# EAGLE design sensorX (EAGLE 7.2.0)
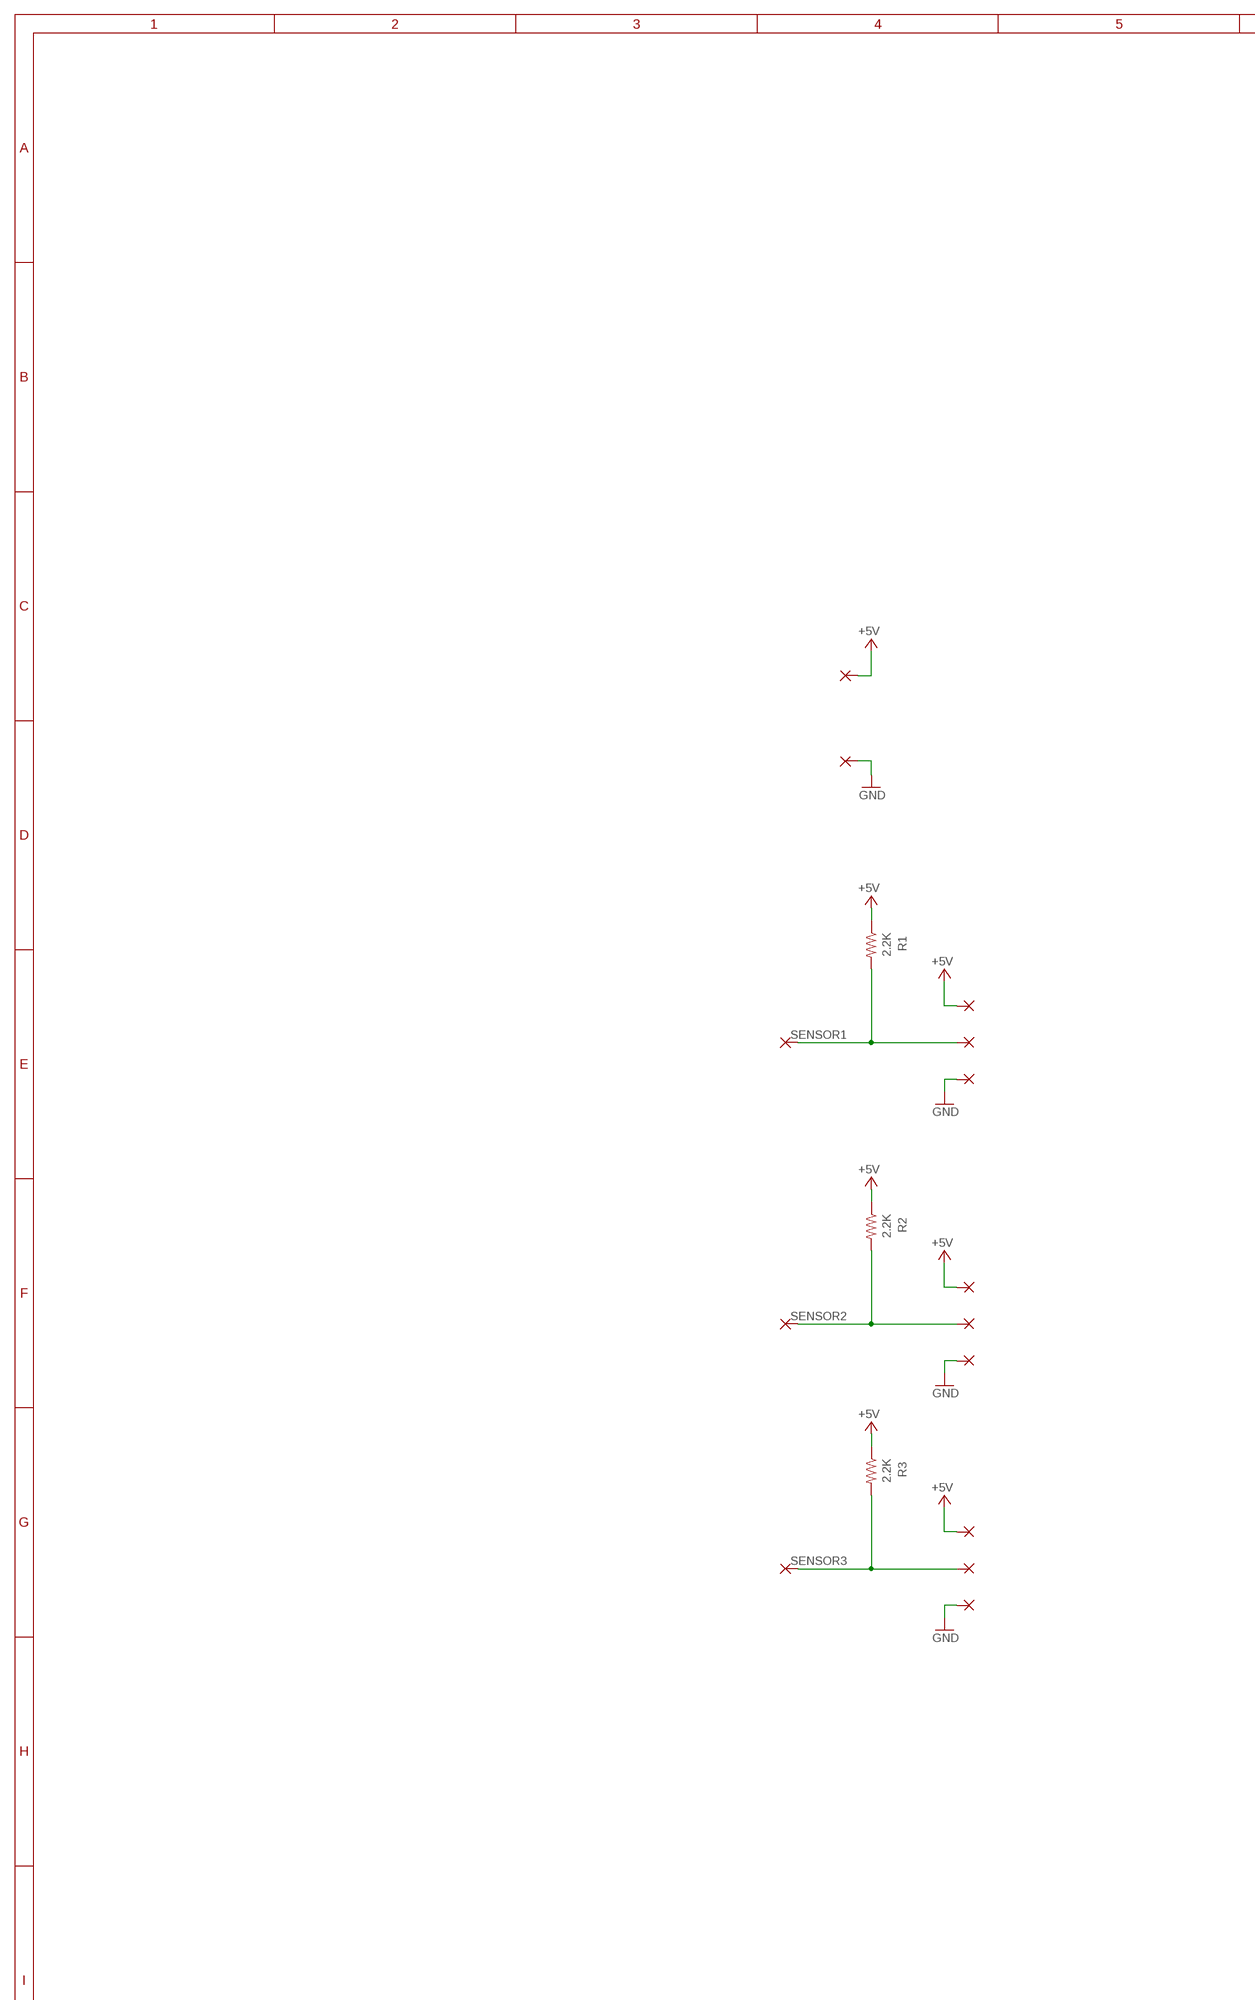
[diagram p0: schematic, sheet 1, part 1 of 2]
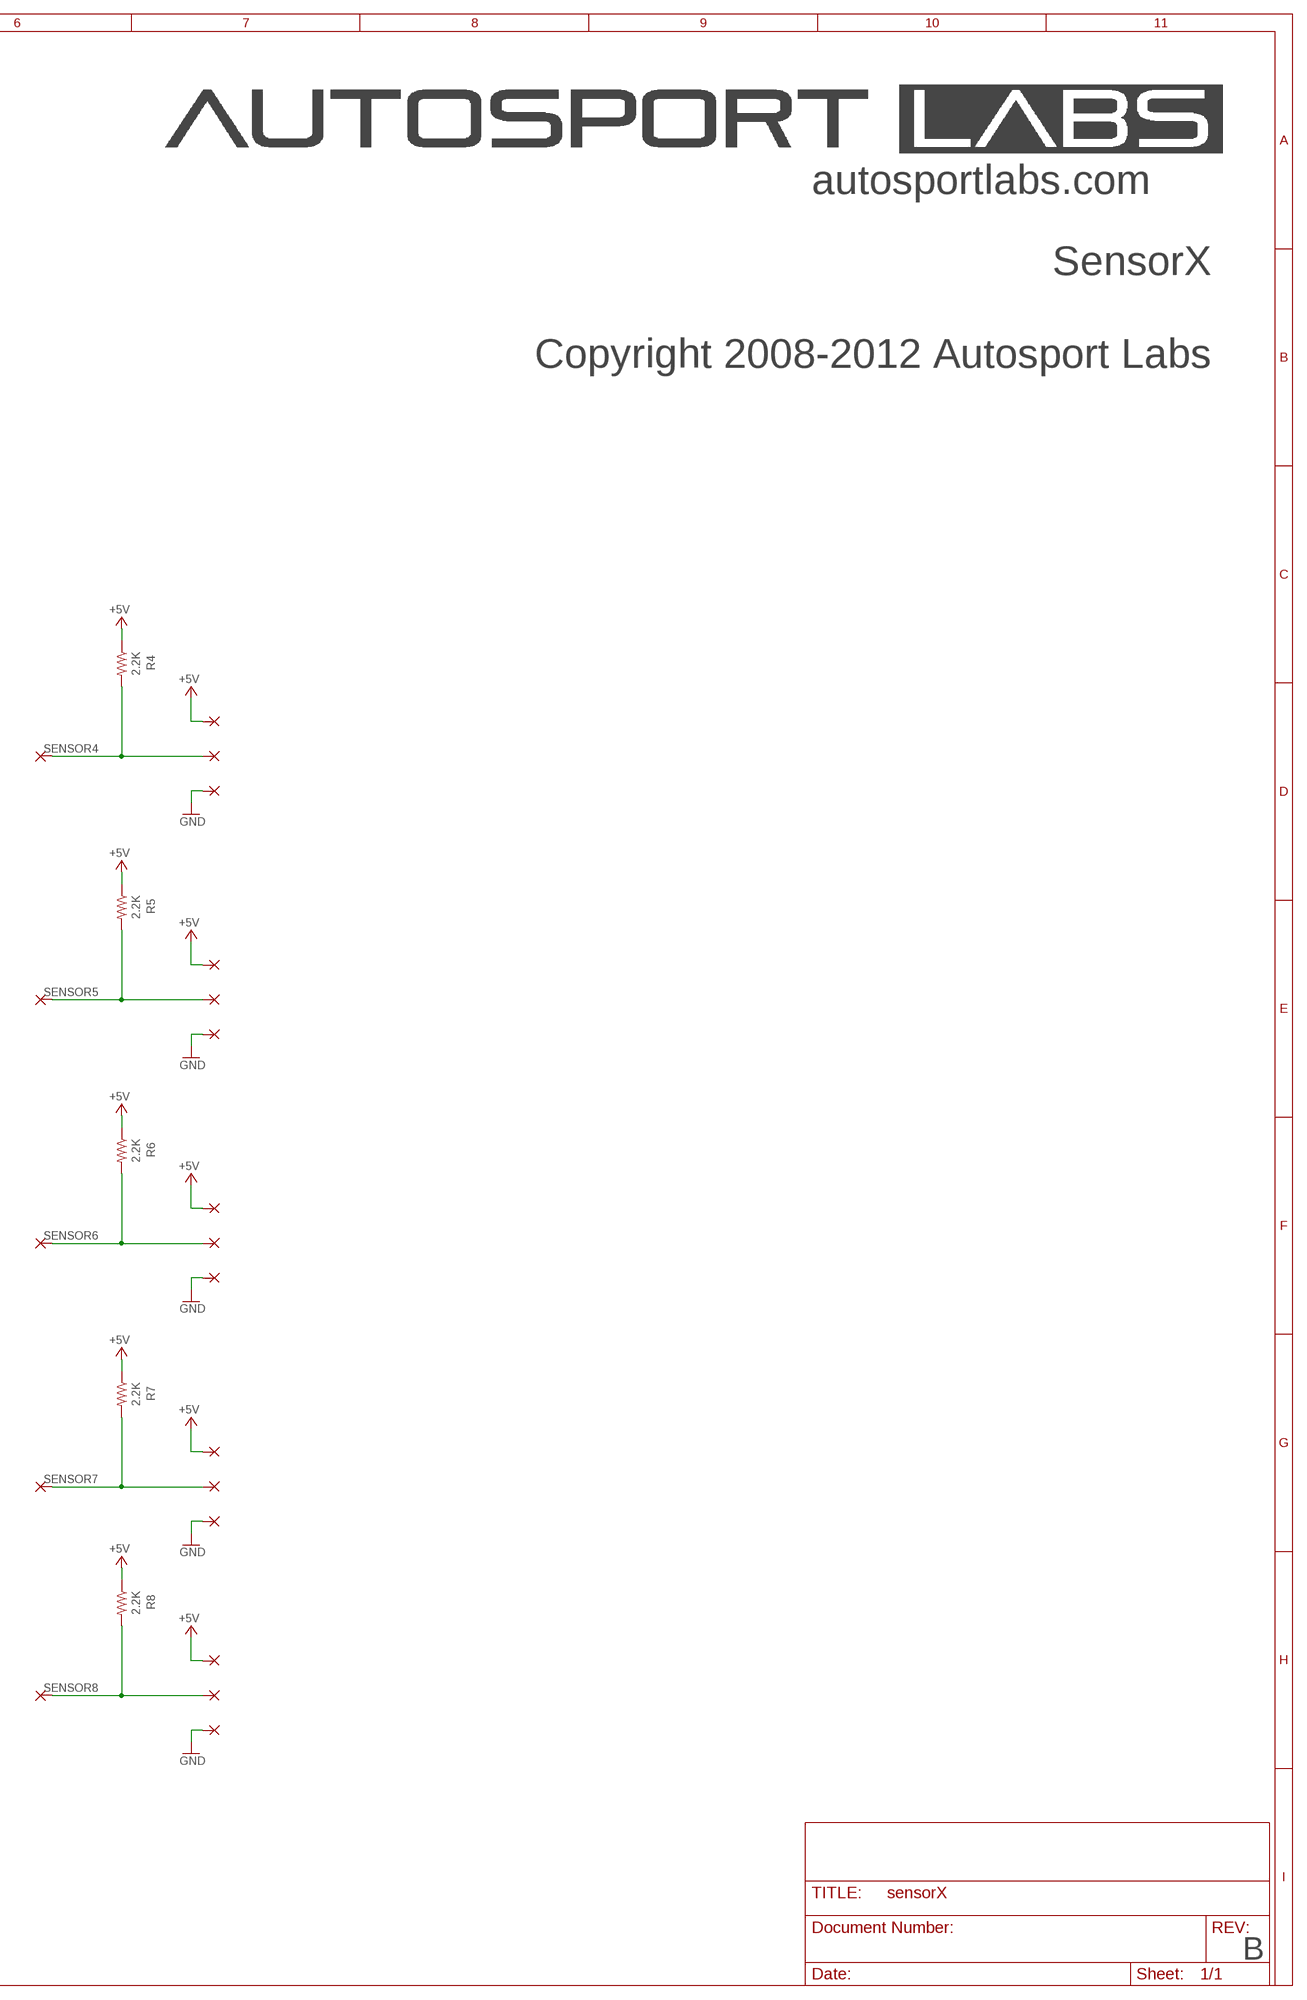
[diagram p1: schematic, sheet 1, part 2 of 2]

## Parts
1  WIREPAD3,17/1,2  [3,17/1,2]
2  WIREPAD3,17/1,2  [3,17/1,2]
3  WIREPAD3,17/1,2  [3,17/1,2]
4  WIREPAD3,17/1,2  [3,17/1,2]
5  WIREPAD3,17/1,2  [3,17/1,2]
5V  WIREPAD3,17/1,2  [3,17/1,2]
5V_1  WIREPAD3,17/1,2  [3,17/1,2]
5V_2  WIREPAD3,17/1,2  [3,17/1,2]
5V_3  WIREPAD3,17/1,2  [3,17/1,2]
5V_4  WIREPAD3,17/1,2  [3,17/1,2]
5V_5  WIREPAD3,17/1,2  [3,17/1,2]
5V_6  WIREPAD3,17/1,2  [3,17/1,2]
5V_7  WIREPAD3,17/1,2  [3,17/1,2]
5V_8  WIREPAD3,17/1,2  [3,17/1,2]
6  WIREPAD3,17/1,2  [3,17/1,2]
7  WIREPAD3,17/1,2  [3,17/1,2]
7_IN  WIREPAD3,17/1,2  [3,17/1,2]
8  WIREPAD3,17/1,2  [3,17/1,2]
8_IN  WIREPAD3,17/1,2  [3,17/1,2]
GND  WIREPAD3,17/1,2  [3,17/1,2]
GND-1  WIREPAD3,17/1,2  [3,17/1,2]
GND_2  WIREPAD3,17/1,2  [3,17/1,2]
GND_3  WIREPAD3,17/1,2  [3,17/1,2]
GND_4  WIREPAD3,17/1,2  [3,17/1,2]
GND_5  WIREPAD3,17/1,2  [3,17/1,2]
GND_6  WIREPAD3,17/1,2  [3,17/1,2]
GND_7  WIREPAD3,17/1,2  [3,17/1,2]
GND_8  WIREPAD3,17/1,2  [3,17/1,2]
IN_1  WIREPAD3,17/1,2  [3,17/1,2]
IN_2  WIREPAD3,17/1,2  [3,17/1,2]
IN_3  WIREPAD3,17/1,2  [3,17/1,2]
IN_4  WIREPAD3,17/1,2  [3,17/1,2]
IN_5  WIREPAD3,17/1,2  [3,17/1,2]
IN_6  WIREPAD3,17/1,2  [3,17/1,2]
R1  2.2K  R-US_0204/5  [0204/5]
R2  2.2K  R-US_0204/5  [0204/5]
R3  2.2K  R-US_0204/5  [0204/5]
R4  2.2K  R-US_0204/5  [0204/5]
R5  2.2K  R-US_0204/5  [0204/5]
R6  2.2K  R-US_0204/5  [0204/5]
R7  2.2K  R-US_0204/5  [0204/5]
R8  2.2K  R-US_0204/5  [0204/5]

## Nets
+5V: 5V.1(P) 5V_1.1(P) 5V_2.1(P) 5V_3.1(P) 5V_4.1(P) 5V_5.1(P) 5V_6.1(P) 5V_7.1(P) 5V_8.1(P) R1.1 R2.1 R3.1 R4.1 R5.1 R6.1 R7.1 R8.1
GND: GND-1.1(P) GND.1(P) GND_2.1(P) GND_3.1(P) GND_4.1(P) GND_5.1(P) GND_6.1(P) GND_7.1(P) GND_8.1(P)
SENSOR1: 1.1(P) IN_1.1(P) R1.2
SENSOR2: 2.1(P) IN_2.1(P) R2.2
SENSOR3: 3.1(P) IN_3.1(P) R3.2
SENSOR4: 4.1(P) IN_4.1(P) R4.2
SENSOR5: 5.1(P) IN_5.1(P) R5.2
SENSOR6: 6.1(P) IN_6.1(P) R6.2
SENSOR7: 7.1(P) 7_IN.1(P) R7.2
SENSOR8: 8.1(P) 8_IN.1(P) R8.2

## Notes on the sheet
- autosportlabs.com
- SensorX
- Copyright 2008-2012 Autosport Labs
- B

## Library data of the parts
1-5 5V 5V_1-5V_8 6 7 7_IN 8 8_IN GND GND-1 GND_2-GND_8 IN_1-IN_6 = wirepad:WIREPAD: Wire PAD connect wire on PCB
R1-R8 = rcl:R-US_: RESISTOR, American symbol

## Board
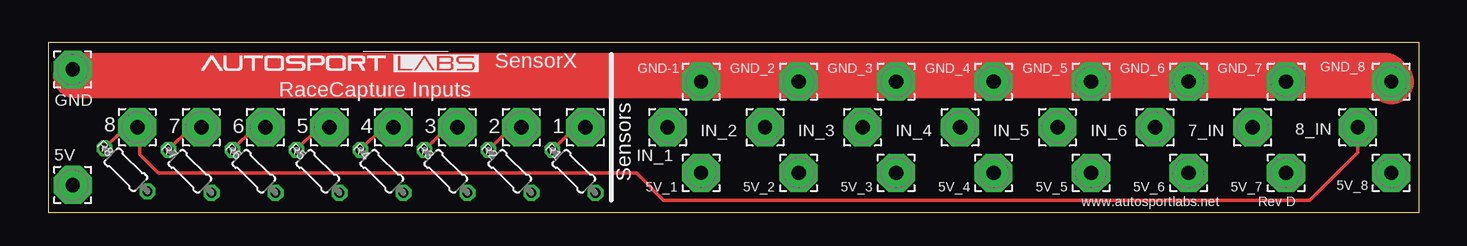
[diagram p2: board, top side]
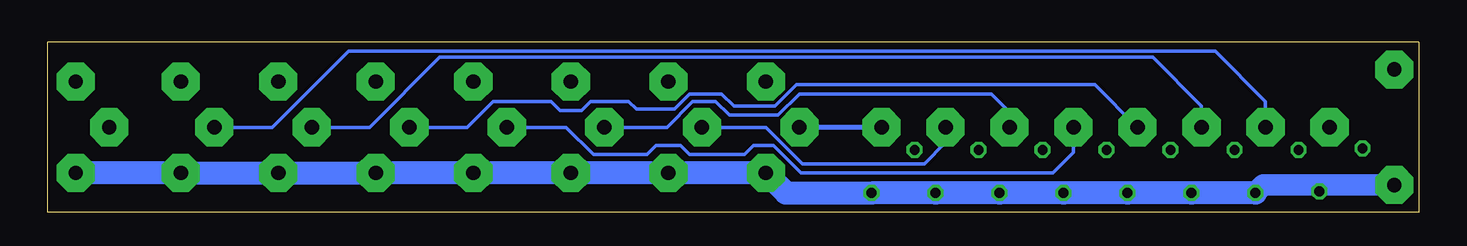
[diagram p3: board, bottom side, seen from below]

Size 114.3 x 14.22 mm. Coordinates in mm from the lower left corner, seen from the top.
Outline: 0,0 114.3,0 114.3,14.22 0,14.22 0,0
Copper layers (1*16): Top 0.035mm / dielectric 1.5mm / Bottom 0.035mm
Design rules "default *": minimum track width 10mil, minimum drill 24mil, track to track 8mil, track to pad 8mil, pad to pad 8mil, via to via 8mil, smd to smd 8mil, copper to edge 10mil, drill to drill 8mil, minimum pad ring 10mil, minimum via ring 8mil, stop-mask expansion 4mil, vias tented up to drill 0mil, thermal gap 10mil

### Footprints (pad centres in the part's own frame; a part is rotated, then mirrored left to right if it is on the bottom)
3,17/1,2 = drill 1.194 pad 3.175 octagon: 1 0,0
0204/5 = drill 0.813 octagon: 1 -2.54,0; 2 2.54,0

### Placement (x,y rotation side)
1  44.77,7.11 0 top
2  39.43,7.11 0 top
3  34.1,7.11 0 top
4  28.77,7.11 0 top
5  23.43,7.11 0 top
5V  2.03,2.29 90 top
5V_1  54.42,3.3 0 top
5V_2  62.55,3.3 0 top
5V_3  70.68,3.3 0 top
5V_4  78.8,3.3 0 top
5V_5  86.93,3.3 0 top
5V_6  95.06,3.3 0 top
5V_7  103.19,3.3 0 top
5V_8  111.95,3.3 0 top
6  18.1,7.11 0 top
7  12.76,7.11 0 top
7_IN  100.39,7.11 0 top
8  7.43,7.11 0 top
8_IN  109.16,7.11 0 top
GND  2.03,11.94 0 top
GND-1  54.42,10.92 0 top
GND_2  62.55,10.92 0 top
GND_3  70.68,10.92 0 top
GND_4  78.8,10.92 0 top
GND_5  86.93,10.92 0 top
GND_6  95.06,10.92 0 top
GND_7  103.19,10.92 0 top
GND_8  111.95,10.92 0 top
IN_1  51.63,7.11 0 top
IN_2  59.75,7.11 0 top
IN_3  67.88,7.11 0 top
IN_4  76.01,7.11 0 top
IN_5  84.14,7.11 0 top
IN_6  92.27,7.11 0 top
R1  43.82,3.43 135 top
R2  38.48,3.43 135 top
R3  33.15,3.43 135 top
R4  27.81,3.43 135 top
R5  22.48,3.43 135 top
R6  17.15,3.43 135 top
R7  11.81,3.43 135 top
R8  6.48,3.56 135 top

### Tracks (layer width: path | path; a pad name or v marks a point on that pad's centre or on a via)
+5V
  Bottom 0.305: R8.1 8.64,2.12 8.64,2.29
  Bottom 1.778: R7.1 12.95,2.29 8.64,2.29 5V.1
  Bottom 1.93: R7.1 R6.1 R5.1 R4.1 R3.1 R2.1 R1.1 52.75,1.63 5V_1.1 5V_2.1 5V_3.1 5V_4.1 5V_5.1 5V_6.1 5V_7.1 5V_8.1
GND
  Top 0.305: 2.29,11.43 7.62,11.94 GND.1
  Top 2.54: 103.19,11.43 GND_7.1 | GND_6.1 95.06,10.79 95.31,11.05 95.31,11.43 | 86.93,11.43 GND_5.1 | GND_4.1 78.93,11.05 78.93,11.43 | 70.68,11.43 GND_3.1 | GND_2.1 62.8,11.18 62.8,11.43 | GND-1.1 54.29,11.05 54.29,11.43
  Top 3.81: 2.29,11.43 54.29,11.43 62.8,11.43 70.68,11.43 78.93,11.43 86.93,11.43 95.31,11.43 103.19,11.43 111.44,11.43 GND_8.1
SENSOR1
  Top 0.305: R1.2 43.91,7.11 1.1
  Bottom 0.406: 1.1 IN_1.1
SENSOR2
  Top 0.305: R2.2 38.57,7.11 2.1
  Bottom 0.305: IN_2.1 54.42,7.11 51.37,4.06 41.21,4.06 39.43,5.84 2.1
SENSOR3
  Top 0.305: R3.2 33.24,7.11 3.1
  Bottom 0.305: IN_3.1 62.67,7.11 60.52,9.27 58.61,9.27 57.47,8.13 53.4,8.13 51.63,9.91 35.62,9.91 34.1,8.38 3.1
SENSOR4
  Top 0.305: R4.2 27.9,7.11 4.1
  Bottom 0.305: IN_4.1 71.06,7.11 68.77,4.83 64.33,4.83 63.56,5.59 61.53,5.59 60.77,4.83 56.2,4.83 55.44,5.59 53.78,5.59 51.5,3.3 30.48,3.3 28.77,5.02 4.1
SENSOR5
  Top 0.305: R5.2 22.57,7.11 5.1
  Bottom 0.305: IN_5.1 79.31,7.11 77.15,9.27 72.33,9.27 71.56,8.51 69.79,8.51 69.03,9.27 65.85,9.27 65.22,8.64 62.04,8.64 60.77,9.91 58.1,9.91 57.09,8.89 53.66,8.89 51.88,10.67 26.99,10.67 5.1
SENSOR6
  Top 0.305: R6.2 17.24,7.11 6.1
  Bottom 0.305: IN_6.1 87.44,7.11 81.6,12.95 22.16,12.95 18.1,8.89 6.1
SENSOR7
  Top 0.305: R7.2 11.9,7.11 7.1
  Bottom 0.305: 7_IN.1 95.57,7.11 89.22,13.46 16.95,13.46 12.76,9.27 7.1
SENSOR8
  Top 0.305: R8.2 6.44,7.11 8.1 7.62,6.92 7.62,4.83 9.14,3.3 49.02,3.3 51.31,1.02 105.16,1.02 109.16,5.02 8_IN.1

### Text on the board
tPlace: SensorX | RaceCapture Inputs | Sensors | www.autosportlabs.net | Rev D